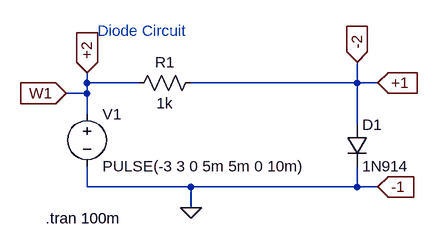
[diagram p0: schematic diode_cir.asc]
diode_cir.asc, the LTspice schematic file:
Version 4
SHEET 1 880 680
WIRE 32 -224 32 -240
WIRE 112 -224 32 -224
WIRE 448 -224 448 -256
WIRE 448 -224 192 -224
WIRE 480 -224 448 -224
WIRE 32 -208 32 -224
WIRE 32 -208 0 -208
WIRE 32 -176 32 -208
WIRE 448 -160 448 -224
WIRE 32 -64 32 -96
WIRE 192 -64 32 -64
WIRE 448 -64 448 -96
WIRE 448 -64 192 -64
WIRE 480 -64 448 -64
WIRE 192 -32 192 -64
FLAG 192 -32 0
FLAG 32 -240 +2
IOPIN 32 -240 In
FLAG 448 -256 -2
IOPIN 448 -256 In
FLAG 480 -224 +1
IOPIN 480 -224 In
FLAG 480 -64 -1
IOPIN 480 -64 In
FLAG 0 -208 W1
IOPIN 0 -208 In
SYMBOL diode 432 -160 R0
SYMATTR InstName D1
SYMATTR Value 1N914
SYMBOL res 208 -240 R90
WINDOW 0 0 56 VBottom 2
WINDOW 3 32 56 VTop 2
SYMATTR InstName R1
SYMATTR Value 1k
SYMBOL voltage 32 -192 R0
WINDOW 123 0 0 Left 0
WINDOW 39 0 0 Left 0
SYMATTR InstName V1
SYMATTR Value PULSE(-3 3 0 5m 5m 0 10m)
TEXT -32 -16 Left 2 !.tran 100m
TEXT 48 -304 Left 2 ;Diode Circuit

The netlist it stands for:
* diode_cir.asc
D1 +1 0 1N914
R1 +1 W1 1k
V1 W1 0 PULSE(-3 3 0 5m 5m 0 10m)
.model D D
.lib standard.dio
.tran 100m
* Diode Circuit
.backanno
.end